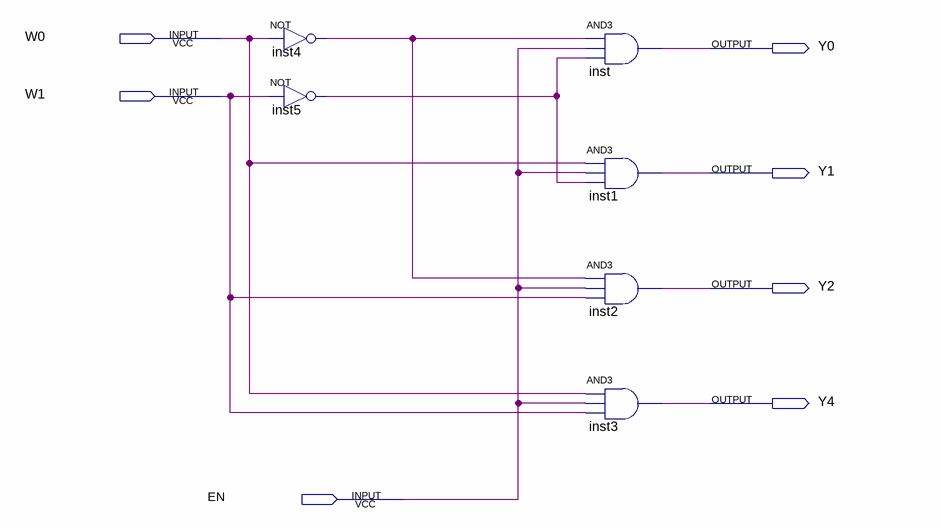
[diagram p0: schematic sheet]
// Quartus schematic decoder2to4.bdf as structural Verilog: 6 symbols, 7 pins
module decoder2to4 (
  input  W0,
  input  W1,
  input  EN,
  output Y0,
  output Y1,
  output Y2,
  output Y4
);

  wire inst4_out, inst5_out;

  not inst4 (inst4_out, W0);
  not inst5 (inst5_out, W1);
  and inst (Y0, inst4_out, EN, inst5_out);
  and inst1 (Y1, W0, EN, inst5_out);
  and inst2 (Y2, inst4_out, EN, W1);
  and inst3 (Y4, W0, EN, W1);
endmodule
